# Altium schematic sheet 0-Hierarchy.SchDoc
size A4; Author: Fabian Castaño; CompanyName: UdeA; Engineer: Fabian Castaño; Organization: Universidad de Antioquia; Address1: UdeA; Address2: Medellín; Address3: Antioquia; Address4: Colombia 050010; DocumentNumber: 1; Revision: Jaime Osorio; SheetNumber: 1; SheetTotal: 12
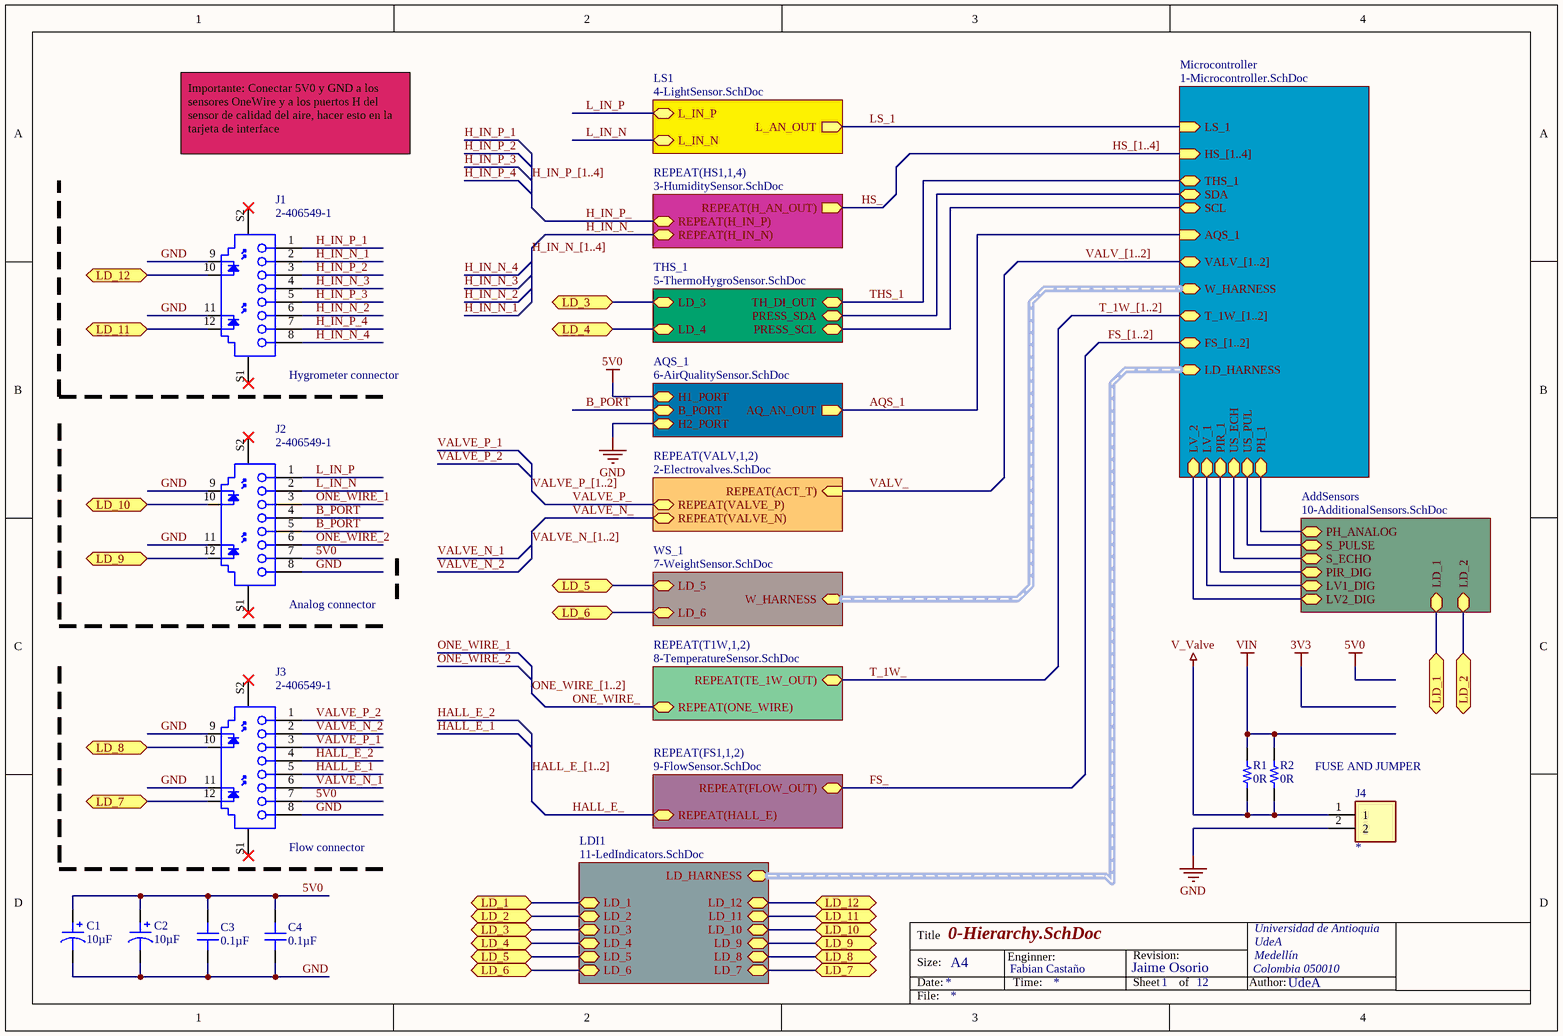
[diagram p0: 0-Hierarchy.SchDoc]

## Parts
C1  10µF  [CAP POL 1206_3216]
C2  10µF  [CAP POL 1206_3216]
C3  0.1µF  [CAP 0805_2012]
C4  0.1µF  [CAP 0805_2012]
J1  2-406549-1  [TECO-2-406549-1_V]
J2  2-406549-1  [TECO-2-406549-1_V]
J3  2-406549-1  [TECO-2-406549-1_V]
J4  282841-2  [TE_282841-2]  (value not drawn)
R1  0R  [RES 0805_2012]
R2  0R  [RES 0805_2012]

## Sub-sheets
AddSensors = 10-AdditionalSensors.SchDoc: PH_ANALOG, S_PULSE, S_ECHO, PIR_DIG, LV1_DIG, LV2_DIG, LD_1 (bidir), LD_2 (bidir)
AQS_1 = 6-AirQualitySensor.SchDoc: AQ_AN_OUT (out), B_PORT, H1_PORT, H2_PORT
LDI1 = 11-LedIndicators.SchDoc: LD_HARNESS (harness LedHarness), LD_1, LD_2, LD_3, LD_4, LD_5, LD_6, LD_7, LD_8, LD_9, LD_10, LD_11, LD_12
LS1 = 4-LightSensor.SchDoc: L_AN_OUT (out), L_IN_P, L_IN_N
Microcontroller = 1-Microcontroller.SchDoc: HS_[1..4] (in), LS_1 (in), THS_1, AQS_1 (in), VALV_[1..2], W_HARNESS (harness Weight_Harness), T_1W_[1..2], FS_[1..2], SDA, SCL, LV_2, LV_1, PIR_1, US_ECH, US_PUL, PH_1, LD_HARNESS (harness LedHarness)
REPEAT(FS1,1,2) = 9-FlowSensor.SchDoc: REPEAT(FLOW_OUT), REPEAT(HALL_E)
REPEAT(HS1,1,4) = 3-HumiditySensor.SchDoc: REPEAT(H_AN_OUT) (out), REPEAT(H_IN_P), REPEAT(H_IN_N)
REPEAT(T1W,1,2) = 8-TemperatureSensor.SchDoc: REPEAT(TE_1W_OUT), REPEAT(ONE_WIRE)
REPEAT(VALV,1,2) = 2-Electrovalves.SchDoc: REPEAT(ACT_T) (in), REPEAT(VALVE_N), REPEAT(VALVE_P)
THS_1 = 5-ThermoHygroSensor.SchDoc: TH_DI_OUT, PRESS_SDA, PRESS_SCL, LD_3, LD_4
WS_1 = 7-WeightSensor.SchDoc: W_HARNESS (harness Weight_Harness), LD_5, LD_6

## Ports
LD_1 (bidir), LD_2 (bidir), LD_3 (bidir), LD_4 (bidir), LD_5 (bidir), LD_6 (bidir), LD_7 (bidir), LD_8 (bidir), LD_9 (bidir), LD_10 (bidir), LD_11 (bidir), LD_12 (bidir)

## Nets
5V0: C1.1 C2.1 C3.2 C4.2 J2.7 J3.7 ; sheet AQS_1/H1_PORT
GND: C1.2 C2.2 C3.1 C4.1 J1.9 J1.11 J2.8 J2.9 J2.11 J3.8 J3.9 J3.11 J4.2 ; sheet AQS_1/H2_PORT
V_Valve: J4.1 R1.1 R2.1
VIN: R1.2 R2.2
AQS_1: sheet Microcontroller/AQS_1, sheet AQS_1/AQ_AN_OUT
B_PORT: J2.4 J2.5 ; sheet AQS_1/B_PORT
FS_: sheet REPEAT(FS1,1,2)/REPEAT(FLOW_OUT)
H_IN_N_: sheet REPEAT(HS1,1,4)/REPEAT(H_IN_N)
H_IN_N_1: J1.2
H_IN_N_2: J1.6
H_IN_N_3: J1.4
H_IN_N_4: J1.8
H_IN_P_: sheet REPEAT(HS1,1,4)/REPEAT(H_IN_P)
H_IN_P_1: J1.1
H_IN_P_2: J1.3
H_IN_P_3: J1.5
H_IN_P_4: J1.7
HALL_E_: sheet REPEAT(FS1,1,2)/REPEAT(HALL_E)
HALL_E_1: J3.5
HALL_E_2: J3.4
HS_: sheet REPEAT(HS1,1,4)/REPEAT(H_AN_OUT)
L_IN_N: J2.2 ; sheet LS1/L_IN_N
L_IN_P: J2.1 ; sheet LS1/L_IN_P
LD_1: port LD_1, sheet AddSensors/LD_1, sheet LDI1/LD_1
LD_2: port LD_2, sheet AddSensors/LD_2, sheet LDI1/LD_2
LD_3: port LD_3, sheet THS_1/LD_3, sheet LDI1/LD_3
LD_4: port LD_4, sheet THS_1/LD_4, sheet LDI1/LD_4
LD_5: port LD_5, sheet WS_1/LD_5, sheet LDI1/LD_5
LD_6: port LD_6, sheet WS_1/LD_6, sheet LDI1/LD_6
LD_7: J3.12 ; port LD_7, sheet LDI1/LD_7
LD_8: J3.10 ; port LD_8, sheet LDI1/LD_8
LD_9: J2.12 ; port LD_9, sheet LDI1/LD_9
LD_10: J2.10 ; port LD_10, sheet LDI1/LD_10
LD_11: J1.12 ; port LD_11, sheet LDI1/LD_11
LD_12: J1.10 ; port LD_12, sheet LDI1/LD_12
LS_1: sheet Microcontroller/LS_1, sheet LS1/L_AN_OUT
ONE_WIRE_: sheet REPEAT(T1W,1,2)/REPEAT(ONE_WIRE)
ONE_WIRE_1: J2.3
ONE_WIRE_2: J2.6
T_1W_: sheet REPEAT(T1W,1,2)/REPEAT(TE_1W_OUT)
THS_1: sheet Microcontroller/THS_1, sheet THS_1/TH_DI_OUT
VALV_: sheet REPEAT(VALV,1,2)/REPEAT(ACT_T)
VALVE_N_: sheet REPEAT(VALV,1,2)/REPEAT(VALVE_N)
VALVE_N_1: J3.6
VALVE_N_2: J3.2
VALVE_P_: sheet REPEAT(VALV,1,2)/REPEAT(VALVE_P)
VALVE_P_1: J3.3
VALVE_P_2: J3.1
(unnamed): sheet Microcontroller/SDA, sheet THS_1/PRESS_SDA
(unnamed): sheet Microcontroller/SCL, sheet THS_1/PRESS_SCL
(unnamed): sheet Microcontroller/LV_2, sheet AddSensors/LV2_DIG
(unnamed): sheet Microcontroller/LV_1, sheet AddSensors/LV1_DIG
(unnamed): sheet Microcontroller/PIR_1, sheet AddSensors/PIR_DIG
(unnamed): sheet Microcontroller/US_ECH, sheet AddSensors/S_ECHO
(unnamed): sheet Microcontroller/US_PUL, sheet AddSensors/S_PULSE
(unnamed): sheet Microcontroller/PH_1, sheet AddSensors/PH_ANALOG

Not connected (* = marked no-connect by the designer): J1 S1* S2*; J2 S1* S2*; J3 S1* S2*

## Buses and harness runs
bus FS_[1..2] = sheet Microcontroller/FS_[1..2]
bus H_IN_N_[1..4]
bus H_IN_P_[1..4]
bus HALL_E_[1..2]
bus HS_[1..4] = sheet Microcontroller/HS_[1..4]
bus ONE_WIRE_[1..2]
bus T_1W_[1..2] = sheet Microcontroller/T_1W_[1..2]
bus VALV_[1..2] = sheet Microcontroller/VALV_[1..2]
bus VALVE_N_[1..2]
bus VALVE_P_[1..2]
harness sheet LDI1/LD_HARNESS = sheet Microcontroller/LD_HARNESS
harness sheet Microcontroller/W_HARNESS = sheet WS_1/W_HARNESS

## Notes on the sheet
- Importante: Conectar 5V0 y GND a los sensores OneWire y a los puertos H del sensor de calidad del aire, hacer esto en la tarjeta de interface
- (near J1) Hygrometer connector
- (near J2) Analog connector
- FUSE AND JUMPER
- (near J3) Flow connector
- Title
- Size:
- Date:
- A4
- Enginner:
- Time:
- Revision:
- Sheet
- of
- Author:
- File:

## Library data of the parts
C1 C2 = TCNK106M025R0350: CAP TANT POLY 10UF 25V 1206; Manufacturer: AVX Corporation; Manufacturer Size Code: K; ESR (Equivalent Series Resistance): 350mOhm @ 100kHz; Lifetime @ Temp.: 2000 Hrs @ 105°C; Tolerance: ±20%; Type: Molded; Part Number: TCNK106M025R0350; Value: 10µF; Capacitance: 10µF; ComponentLink1Description: Datasheet; ComponentLink1URL: http://datasheets.avx.com/TCN_Undertab.pdf; ComponentLink2Description: DigiKey Link; ComponentLink2URL: http://digikey.com/product-detail/en/avx-corporation/TCNK106M025R0350/478-12519-1-ND/9836496; Device Package: 1206 (3216 Metric); Features: General Purpose; Height - Seated (Max): 0.039" (1.00mm); LastUpdated: 2/09/2020 01:16:26; Lifecycle Status: Active; Minimum Order: 1; Mounting Type: Surface Mount; Operating Temperature: -55°C ~ 105°C; Package / Case: 1206 (3216 Metric); Packaging: TapeAndReel; PartId: 2; Part Status: Active; Price: 0.41; Series: TCN; Size / Dimension: 0.126" L x 0.063" W (3.20mm x 1.60mm); Supplier 1: DigiKey; Supplier Part Number 1: 478-12519-1-ND; Voltage - Rated: 25V
C3 C4 = C0805C104M5RACAUTO: CAP CER 0.1UF 50V X7R 0805; Manufacturer: KEMET; Tolerance: ±20%; Part Number: C0805C104M5RACAUTO; Value: 0.1µF; Applications: Automotive, Bypass, Decoupling; Capacitance: 0.1µF; ComponentLink1Description: Datasheet; ComponentLink1URL: https://api.kemet.com/component-edge/download/datasheet/C0805C104M5RACAUTO.pdf; ComponentLink2Description: DigiKey Link; ComponentLink2URL: http://digikey.com/product-detail/en/kemet/C0805C104M5RACAUTO/399-12977-1-ND/5762259; Device Package: 0805 (2012 Metric); LastUpdated: 2/09/2020 01:04:42; Lifecycle Status: Active; Minimum Order: 1; Mounting Type: Surface Mount, MLCC; Operating Temperature: -55°C ~ 125°C; Package / Case: 0805 (2012 Metric); Packaging: TapeAndReel; PartId: 2568; Part Status: Active; Price: 0.02; Ratings: AEC-Q200; Series: SMD Auto X7R; Size / Dimension: 0.079" L x 0.049" W (2.00mm x 1.25mm); Supplier 1: DigiKey; Supplier Part Number 1: 399-12977-1-ND; Temperature Coefficient: X7R; Thickness (Max): 0.035" (0.88mm); Voltage - Rated: 50V
J1-J3 = CMP-2000-05541-1: RJ45 Connector, Pitch 1.016 mm, 8 Position, Height 14.22 mm, Tail Length 3.18 mm, RoHS, Tray; Manufacturer: TE Connectivity; Number of Ports: 1; Tab Direction: Up; Ratings: Cat5; Catalog Drawings: JackSideEntryInverted / JackSideEntryInvertedSide; Number of Positions/Contacts: 8p8c(RJ45,Ethernet); 3D Model: 2-406549-1.pdf; Other Names: 2-406549-1-ND / A97715; Shielding: Shielded,EMIFinger; LED Color: Yellow-Green; Dynamic Catalog: ModularJacks; Connector Type: Jack; Termination: Solder; Mounting Type: ThroughHole; Datasheet URL: http://www.te.com/commerce/DocumentDelivery/DDEController?Action=showdoc&DocId=Customer+Drawing%7F406549%7FT%7Fpdf%7FEnglish%7FENG_CD_406549_T.pdf%7F2-406549-1; Mounting Technology: ThroughHole; Package Reference: 2-406549-1; RoHS Information: 2-406549-1StatementofCompliance; Housing Material: Thermoplastic; Standard Package: 63; Number of Rows: 1; Category: Connectors,Interconnects; Contact Material: PhosphorBronze; Contact Finish Thickness: 50µin(1.27µm); Family: ModularConnectors-Jacks; Packaging: Tray; Datasheet Version: Rev. T, 11/2014; Operating Temperature: -40°C~85°C; Orientation: 90°Angle(Right); Contact Finish: Gold; Features: BoardGuide; Package Description: RJ45 Connector, Pitch 1.016 mm, 8 Position, Height 14.22 mm, Tail Length 3.18 mm; Manufacturer URL: http://www.te.com/
J4 = 282841-2: Conn Terminal Block 2 POS 5.08mm Solder ST Thru-Hole 17.5A/Contact; MF: TE Connectivity; SnapEDA_Link: https://www.snapeda.com/parts/282841-2/TE%20Connectivity%20AMP%20Connectors/view-part/434231/?ref=snap; Availability: Unavailable; TE_purchase_URL: https://www.te.com/usa-en/product-282841-2.html?te_bu=Cor&te_type=disp&te_campaign=seda_glo_cor-seda-global-disp-prtnr-fy19-seda-model-bom-cta_sma-317_1&elqCampaignId=32493; Value: *; EU_RoHS_Compliance: Compliant with Exemptions; Price: None; MP: 282841-2; Package: None; Comment_1: *
R1 R2 = RC0805FR-071K47L: RES SMD 1.47K OHM 1% 1/8W 0805; Manufacturer: Yageo; Power (Watts): 0.125W, 1/8W; Resistance: 1.47 kOhms; Temperature Coefficient: ±100ppm/°C; Part Number: RC0805FR-071K47L; Value: 0R; ComponentLink1Description: Datasheet; ComponentLink1URL: https://www.yageo.com/upload/media/product/productsearch/datasheet/rchip/PYu-RC_Group_51_RoHS_L_10.pdf; ComponentLink2Description: DigiKey Link; ComponentLink2URL: http://digikey.com/product-detail/en/yageo/RC0805FR-071K47L/311-1.47KCRCT-ND/730440; Composition: Thick Film; Device Package: 0805 (2012 Metric); Features: Moisture Resistant; Height - Seated (Max): 0.024" (0.60mm); LastUpdated: 2/09/2020 01:14:46; Lifecycle Status: Active; Minimum Order: 1; Number of Terminations: 2; Operating Temperature: -55°C ~ 155°C; Package / Case: 0805 (2012 Metric); Packaging: CutTape; PartId: 44768; Part Status: Active; Price: 0.10; Series: RC; Size / Dimension: 0.079" L x 0.049" W (2.00mm x 1.25mm); Supplier 1: DigiKey; Supplier Part Number 1: 311-1.47KCRCT-ND; Supplier Device Package: 0805; Tolerance: ±1%